# EAGLE design Nucleo_MMI (EAGLE 7.4.0)
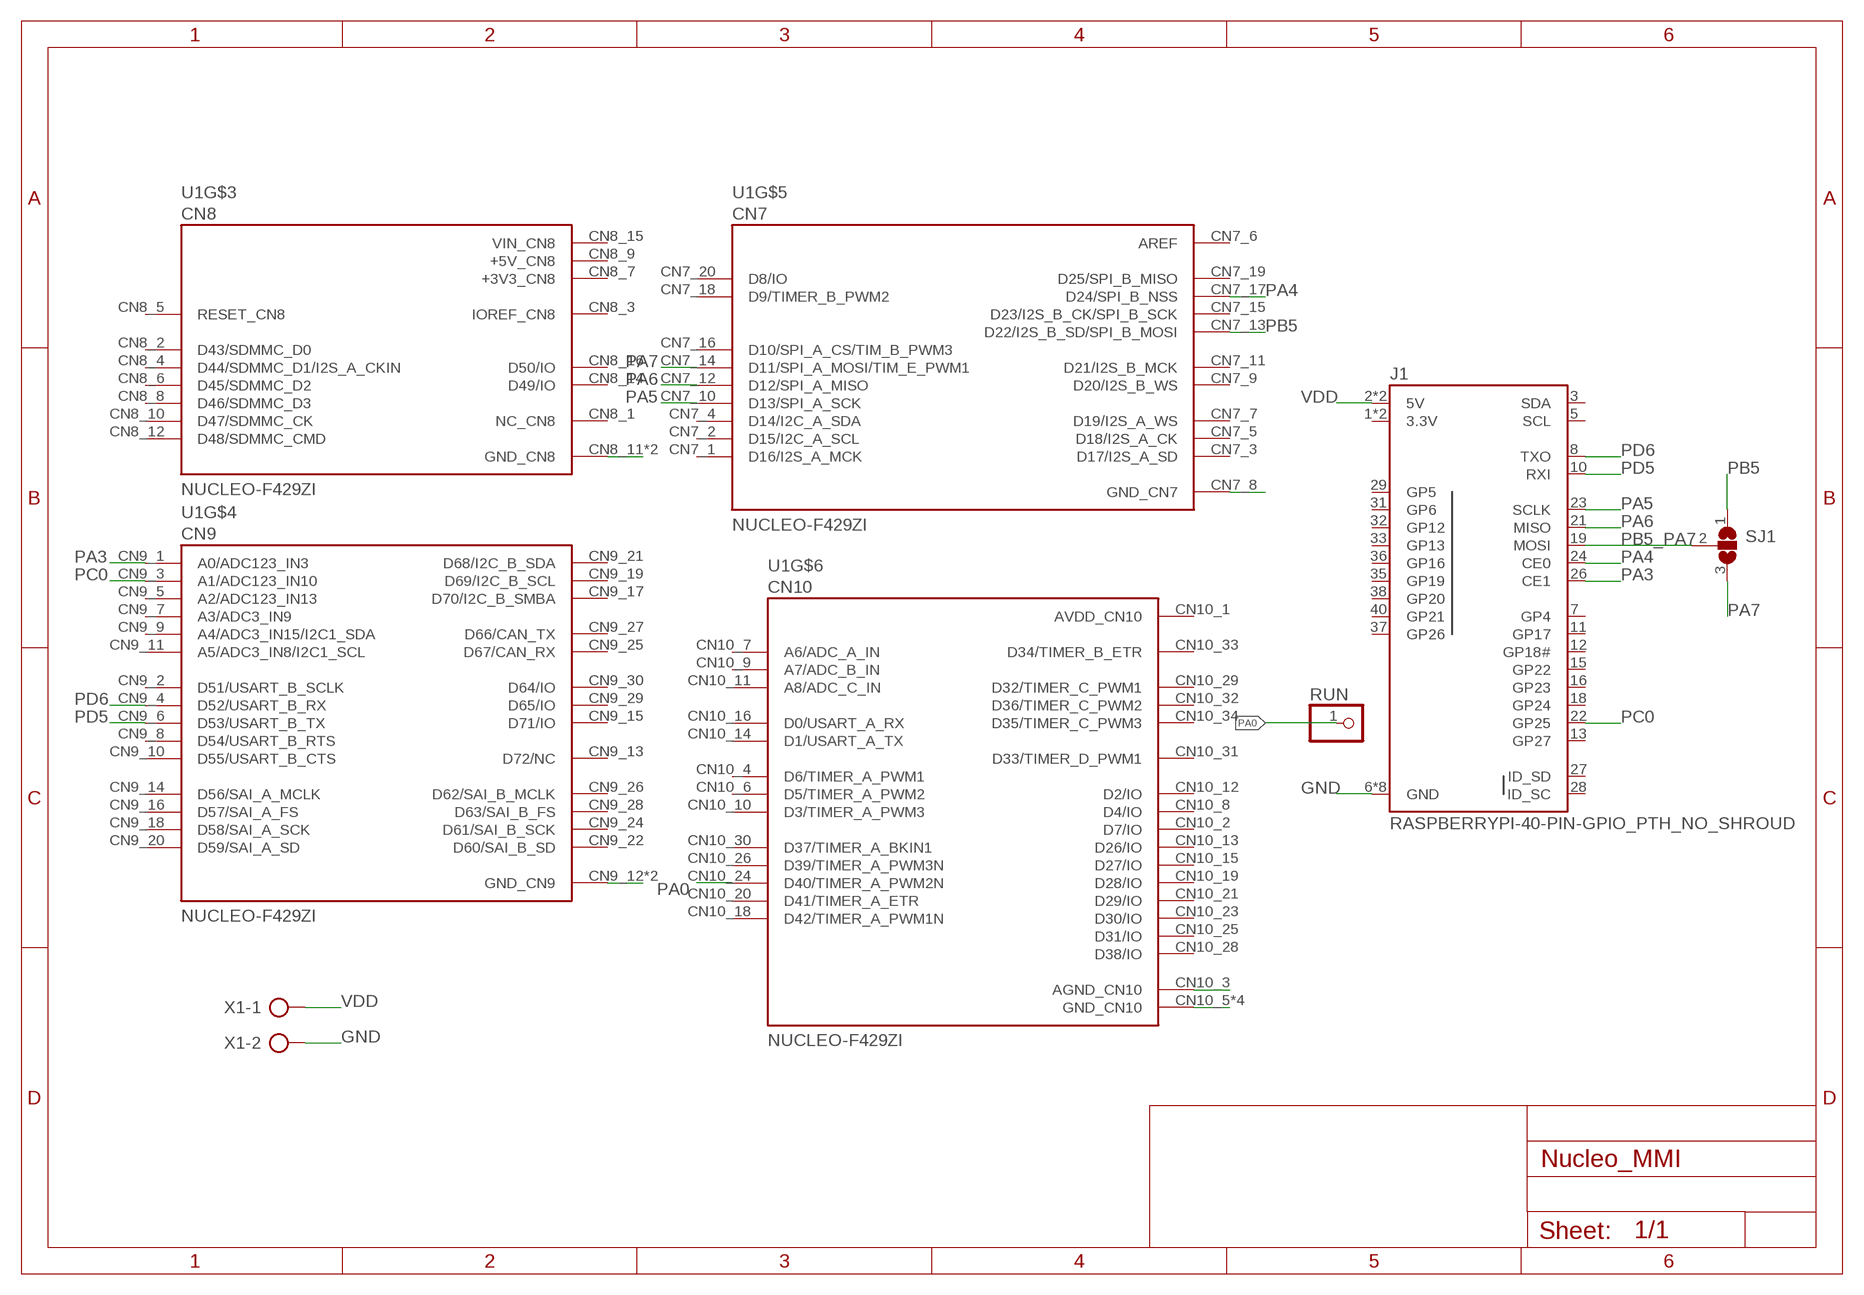
[diagram p0: schematic, sheet 1]

## Parts
J1  RASPBERRYPI-40-PIN-GPIO_PTH_NO_SHROUD  [2X20]
RUN  PINHD-1X1  [1X01]
SJ1  SJ2W  [SJ_2]
U1  NUCLEO-F429ZI  [MODULE_NUCLEO-F429ZI]
X1  AK500/2-H  [AK500/2-H]

## Nets
GND: J1.6(GND) J1.9(GND) J1.14(GND) J1.20(GND) J1.25(GND) J1.30(GND) J1.34(GND) J1.39(GND) U1.CN7_8(GND_CN7) U1.CN8_11(GND_CN8) U1.CN8_13(GND_CN8) U1.CN9_12(GND_CN9) U1.CN9_23(GND_CN9) U1.CN10_3(AGND_CN10) U1.CN10_5(GND_CN10) U1.CN10_17(GND_CN10) U1.CN10_22(GND_CN10) U1.CN10_27(GND_CN10) X1.2
PA0: RUN.1 U1.CN10_24(D40/TIMER_A_PWM2N)
PA3: J1.26(CE1) U1.CN9_1(A0/ADC123_IN3)
PA4: J1.24(CE0) U1.CN7_17(D24/SPI_B_NSS)
PA5: J1.23(SCLK) U1.CN7_10(D13/SPI_A_SCK)
PA6: J1.21(MISO) U1.CN7_12(D12/SPI_A_MISO)
PA7: SJ1.3 U1.CN7_14(D11/SPI_A_MOSI/TIM_E_PWM1)
PB5: SJ1.1 U1.CN7_13(D22/I2S_B_SD/SPI_B_MOSI)
PB5_PA7: J1.19(MOSI) SJ1.2
PC0: J1.22(GP25) U1.CN9_3(A1/ADC123_IN10)
PD5: J1.10(RXI) U1.CN9_6(D53/USART_B_TX)
PD6: J1.8(TXO) U1.CN9_4(D52/USART_B_RX)
VDD: J1.2(5V) J1.4(5V) X1.1
Unconnected: J1.3(SDA) J1.5(SCL) J1.7(GP4) J1.11(GP17) J1.12(GP18#) J1.13(GP27) J1.15(GP22) J1.16(GP23) J1.18(GP24) J1.27(ID_SD) J1.28(ID_SC) J1.29(GP5) J1.31(GP6) J1.32(GP12) J1.33(GP13) J1.35(GP19) J1.36(GP16) J1.37(GP26) J1.38(GP20) J1.40(GP21) U1.CN7_1(D16/I2S_A_MCK) U1.CN7_2(D15/I2C_A_SCL) U1.CN7_3(D17/I2S_A_SD) U1.CN7_4(D14/I2C_A_SDA) U1.CN7_5(D18/I2S_A_CK) U1.CN7_7(D19/I2S_A_WS) U1.CN7_9(D20/I2S_B_WS) U1.CN7_11(D21/I2S_B_MCK) U1.CN7_15(D23/I2S_B_CK/SPI_B_SCK) U1.CN7_16(D10/SPI_A_CS/TIM_B_PWM3) U1.CN7_18(D9/TIMER_B_PWM2) U1.CN7_19(D25/SPI_B_MISO) U1.CN7_20(D8/IO) U1.CN8_1(NC_CN8) U1.CN8_2(D43/SDMMC_D0) U1.CN8_3(IOREF_CN8) U1.CN8_4(D44/SDMMC_D1/I2S_A_CKIN) U1.CN8_5(RESET_CN8) U1.CN8_6(D45/SDMMC_D2) U1.CN8_8(D46/SDMMC_D3) U1.CN8_10(D47/SDMMC_CK) U1.CN8_12(D48/SDMMC_CMD) U1.CN8_14(D49/IO) U1.CN8_16(D50/IO) U1.CN9_2(D51/USART_B_SCLK) U1.CN9_5(A2/ADC123_IN13) U1.CN9_7(A3/ADC3_IN9) U1.CN9_8(D54/USART_B_RTS) U1.CN9_9(A4/ADC3_IN15/I2C1_SDA) U1.CN9_10(D55/USART_B_CTS) U1.CN9_11(A5/ADC3_IN8/I2C1_SCL) U1.CN9_13(D72/NC) U1.CN9_14(D56/SAI_A_MCLK) U1.CN9_15(D71/IO) U1.CN9_16(D57/SAI_A_FS) U1.CN9_17(D70/I2C_B_SMBA) U1.CN9_18(D58/SAI_A_SCK) U1.CN9_19(D69/I2C_B_SCL) U1.CN9_20(D59/SAI_A_SD) U1.CN9_21(D68/I2C_B_SDA) U1.CN9_22(D60/SAI_B_SD) U1.CN9_24(D61/SAI_B_SCK) U1.CN9_25(D67/CAN_RX) U1.CN9_26(D62/SAI_B_MCLK) U1.CN9_27(D66/CAN_TX) U1.CN9_28(D63/SAI_B_FS) U1.CN9_29(D65/IO) U1.CN9_30(D64/IO) U1.CN10_2(D7/IO) U1.CN10_4(D6/TIMER_A_PWM1) U1.CN10_6(D5/TIMER_A_PWM2) U1.CN10_7(A6/ADC_A_IN) U1.CN10_8(D4/IO) U1.CN10_9(A7/ADC_B_IN) U1.CN10_10(D3/TIMER_A_PWM3) U1.CN10_11(A8/ADC_C_IN) U1.CN10_12(D2/IO) U1.CN10_13(D26/IO) U1.CN10_14(D1/USART_A_TX) U1.CN10_15(D27/IO) U1.CN10_16(D0/USART_A_RX) U1.CN10_18(D42/TIMER_A_PWM1N) U1.CN10_19(D28/IO) U1.CN10_20(D41/TIMER_A_ETR) U1.CN10_21(D29/IO) U1.CN10_23(D30/IO) U1.CN10_25(D31/IO) U1.CN10_26(D39/TIMER_A_PWM3N) U1.CN10_28(D38/IO) U1.CN10_29(D32/TIMER_C_PWM1) U1.CN10_30(D37/TIMER_A_BKIN1) U1.CN10_31(D33/TIMER_D_PWM1) U1.CN10_32(D36/TIMER_C_PWM2) U1.CN10_33(D34/TIMER_B_ETR) U1.CN10_34(D35/TIMER_C_PWM3)

## Power pins joined to a net without a drawn wire
3.3V: J1.1(3.3V) J1.17(3.3V)
+3V3_CN8: U1.CN8_7(+3V3_CN8)
+5V_CN8: U1.CN8_9(+5V_CN8)
AREF: U1.CN7_6(AREF)
AVDD_CN10: U1.CN10_1(AVDD_CN10)
VIN_CN8: U1.CN8_15(VIN_CN8)

## Library data of the parts
J1 = SparkFun-Connectors:RASPBERRYPI-40-PIN-GPIO: Raspberry Pi GPIO Header 2x20 pin connector, as found on B, B+, A+ models. Both shrouded PTH and SMT versions available. SparkFun Products: GPIO Shrouded Header <https://www.sparkfun.com/products/13054>- PTH SparkFun Pi Wedge (Preassembled) <https://www.sparkfun.com/products/13717>
RUN = pinhead:PINHD-1X1: PIN HEADER
SJ1 = jumper:SJ2W: SMD solder JUMPER
U1 = NUCLEO-F429ZI:NUCLEO-F429ZI: Check availability <https://pricing.snapeda.com/parts/NUCLEO-F429ZI/STMicroelectronics/view-part?ref=eda>; AVAILABILITY: In Stock; CHECK_PRICES: https://www.snapeda.com/parts/NUCLEO-F429ZI/STMicroelectronics/view-part/?ref=eda; DESCRIPTION: STM32F429ZI, mbed-Enabled Development Nucleo-144 STM32F4 ARM® Cortex®-M4 MCU 32-Bit Embedded Evaluation Board; MF: STMicroelectronics; MP: NUCLEO-F429ZI; PACKAGE: None; PRICE: None; SNAPEDA_LINK: https://www.snapeda.com/parts/NUCLEO-F429ZI/STMicroelectronics/view-part/?ref=snap
X1 = con-ptr500:AK500/2-H: CONNECTOR Aug. 2004 / PTR Meßtechnik: Die Bezeichnung der Serie AK505 wurde geändert. Es handelt sich hierbei um AK500 in horizontaler Ausführung.; OC_FARNELL: unknown; OC_NEWARK: unknown

## Board
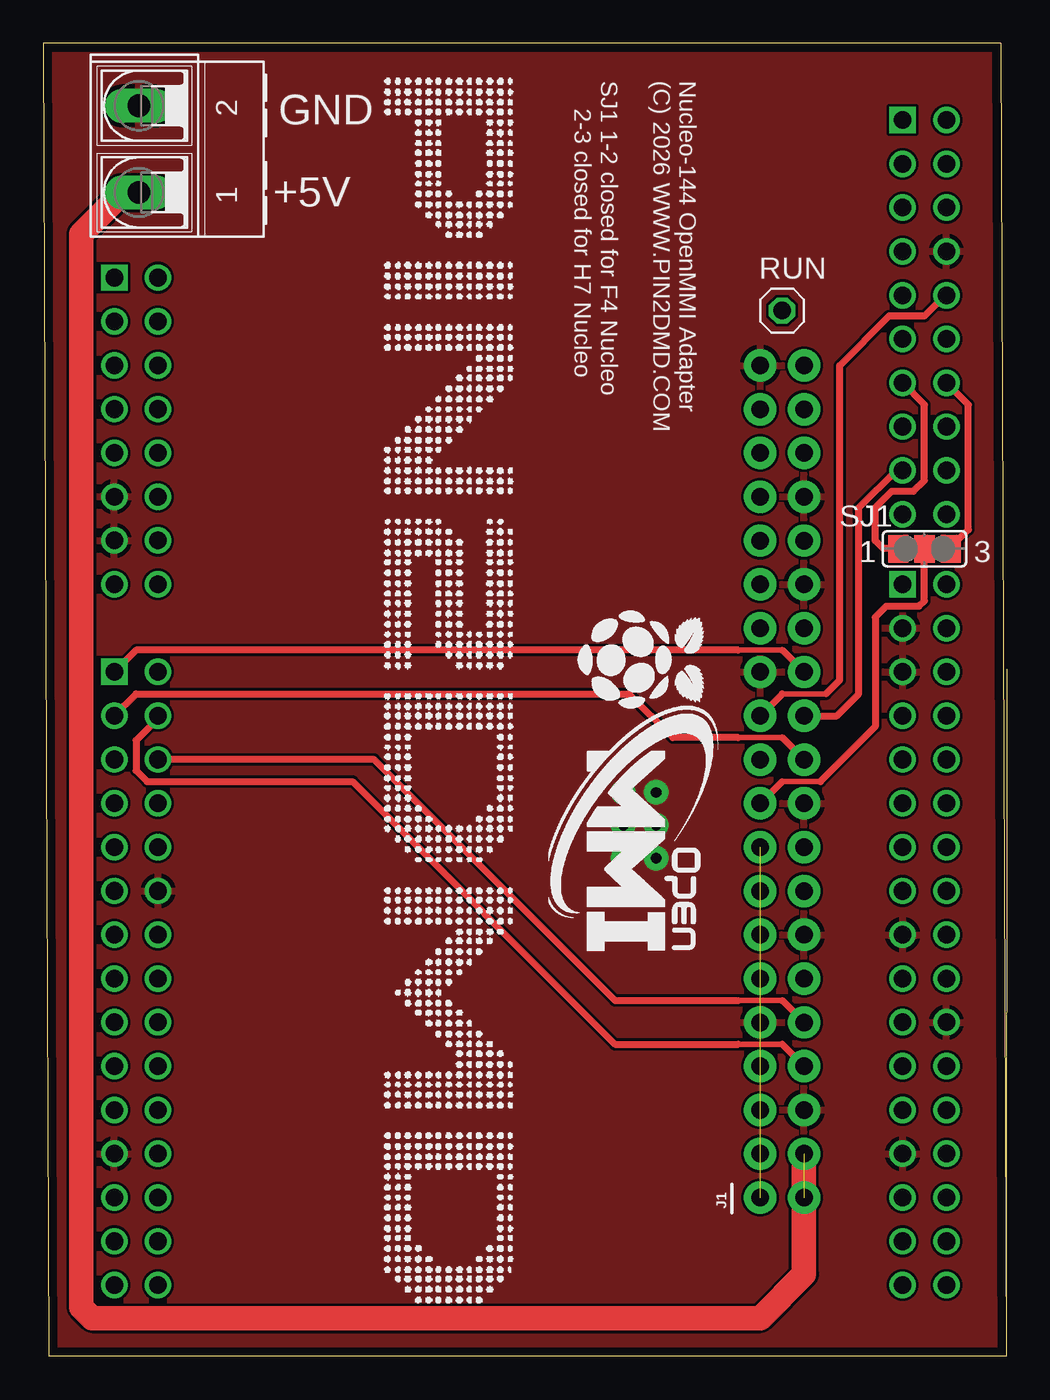
[diagram p1: board, top side]
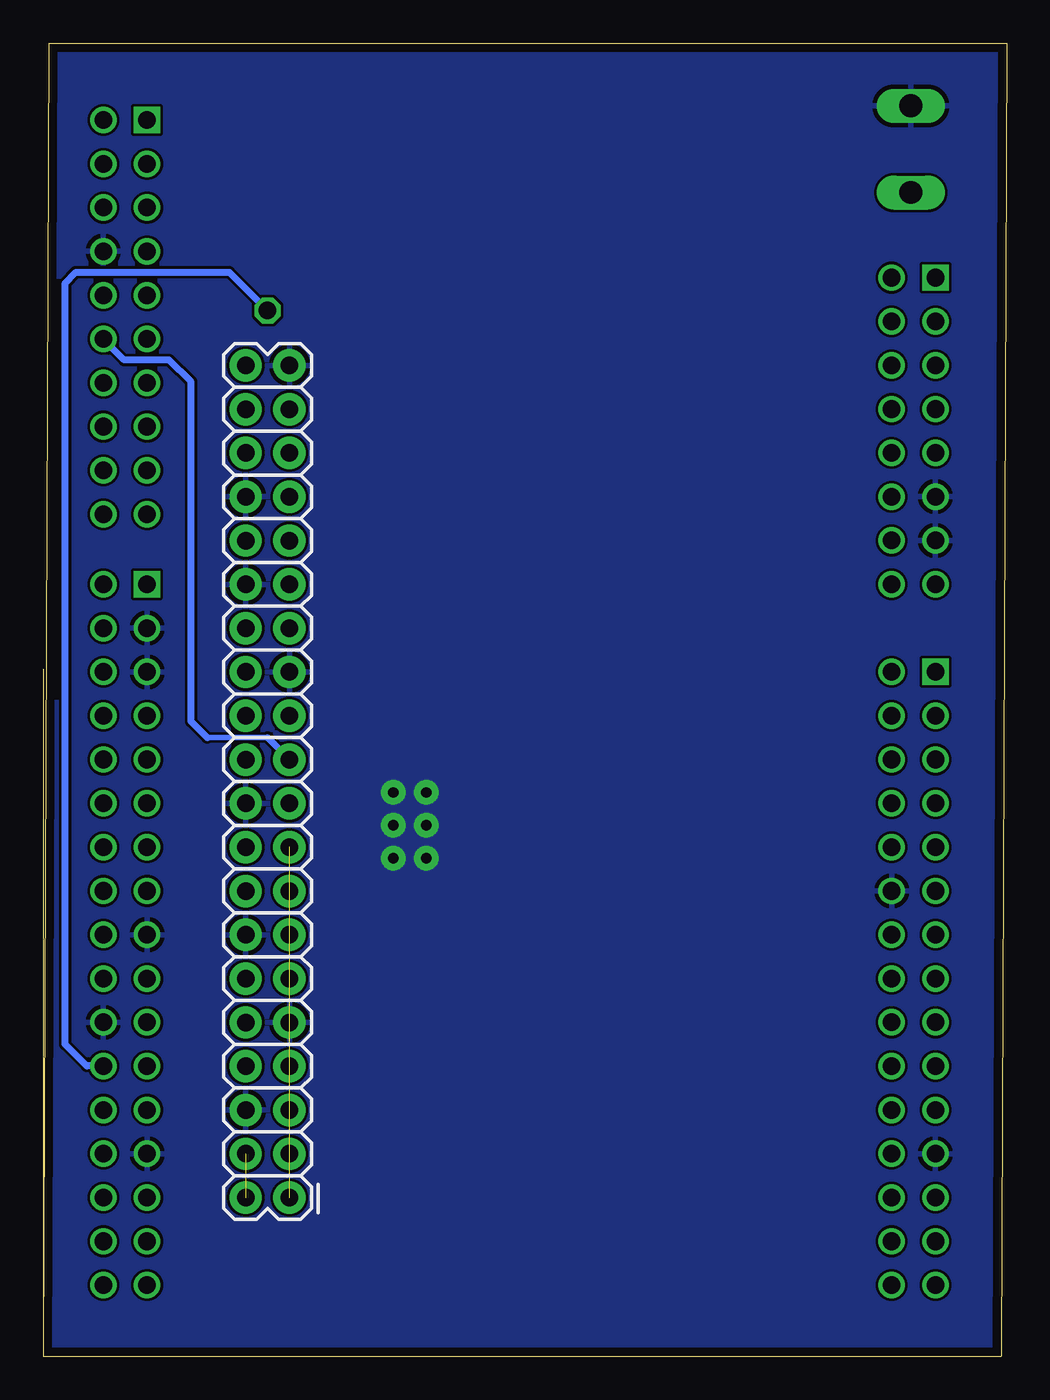
[diagram p2: board, bottom side, seen from below]

Size 55.88 x 76.16 mm. Coordinates in mm from the lower left corner, seen from the top.
Outline: 55.87,0 55.55,76.16 0,76.16 0.32,0 55.87,0
Outline: 55.88,39.85 55.87,0
Copper layers (1*16): Top 0.035mm / dielectric 1.6mm / Bottom 0.035mm
Design rules "Elecrow_2-layer_PCB_eagle_rule": minimum track width 6mil, minimum drill 12mil, track to track 6mil, track to pad 6mil, pad to pad 6mil, via to via 8mil, smd to smd 0mil, copper to edge 20mil, drill to drill 10mil, minimum pad ring 6mil, minimum via ring 6mil, stop-mask expansion 0mil, vias tented up to drill 100mil, thermal gap 10mil

### Footprints (pad centres in the part's own frame; a part is rotated, then mirrored left to right if it is on the bottom)
2X20 = drill 1.016 pad 1.88: 1 0,0; 2 0,2.54; 3 2.54,0; 4 2.54,2.54; 5 5.08,0; 6 5.08,2.54; 7 7.62,0; 8 7.62,2.54; 9 10.16,0; 10 10.16,2.54; 11 12.7,0; 12 12.7,2.54; 13 15.24,0; 14 15.24,2.54; 15 17.78,0; 16 17.78,2.54; 17 20.32,0; 18 20.32,2.54; 19 22.86,0; 20 22.86,2.54; 21 25.4,0; 22 25.4,2.54; 23 27.94,0; 24 27.94,2.54; 25 30.48,0; 26 30.48,2.54; 27 33.02,0; 28 33.02,2.54; 29 35.56,0; 30 35.56,2.54; 31 38.1,0; 32 38.1,2.54; 33 40.64,0; 34 40.64,2.54; 35 43.18,0; 36 43.18,2.54; 37 45.72,0; 38 45.72,2.54; 39 48.26,0; 40 48.26,2.54
1X01 = drill 1.016 octagon: 1 0,0
SJ_2 = smd 1.168 x 1.6: 1 -1.524,0; 2 0,0; 3 1.524,0
MODULE_NUCLEO-F429ZI = drill 1.02 square: CN7_1 20.32,36.454; CN8_1 -25.4,27.31; CN9_1 -25.4,4.45; CN10_1 20.32,9.53 | drill 1.02: CN7_2 22.86,36.454; CN7_3 20.32,33.914; CN7_4 22.86,33.914; CN7_5 20.32,31.374; CN7_6 22.86,31.374; CN7_7 20.32,28.834; CN7_8 22.86,28.834; CN7_9 20.32,26.294; CN7_10 22.86,26.294; CN7_11 20.32,23.754; CN7_12 22.86,23.754; CN7_13 20.32,21.214; CN7_14 22.86,21.214; CN7_15 20.32,18.674; CN7_16 22.86,18.674; CN7_17 20.32,16.134; CN7_18 22.86,16.134; CN7_19 20.32,13.594; CN7_20 22.86,13.594; CN8_2 -22.86,27.31; CN8_3 -25.4,24.77; CN8_4 -22.86,24.77; CN8_5 -25.4,22.23; CN8_6 -22.86,22.23; CN8_7 -25.4,19.69; CN8_8 -22.86,19.69; CN8_9 -25.4,17.15; CN8_10 -22.86,17.15; CN8_11 -25.4,14.61; CN8_12 -22.86,14.61; CN8_13 -25.4,12.07; CN8_14 -22.86,12.07; CN8_15 -25.4,9.53; CN8_16 -22.86,9.53; CN9_2 -22.86,4.45; CN9_3 -25.4,1.91; CN9_4 -22.86,1.91; CN9_5 -25.4,-0.63; CN9_6 -22.86,-0.63; CN9_7 -25.4,-3.17; CN9_8 -22.86,-3.17; CN9_9 -25.4,-5.71; CN9_10 -22.86,-5.71; CN9_11 -25.4,-8.25; CN9_12 -22.86,-8.25; CN9_13 -25.4,-10.79; CN9_14 -22.86,-10.79; CN9_15 -25.4,-13.33; CN9_16 -22.86,-13.33; CN9_17 -25.4,-15.87; CN9_18 -22.86,-15.87; CN9_19 -25.4,-18.41; CN9_20 -22.86,-18.41; CN9_21 -25.4,-20.95; CN9_22 -22.86,-20.95; CN9_23 -25.4,-23.49; CN9_24 -22.86,-23.49; CN9_25 -25.4,-26.03; CN9_26 -22.86,-26.03; CN9_27 -25.4,-28.57; CN9_28 -22.86,-28.57; CN9_29 -25.4,-31.11; CN9_30 -22.86,-31.11; CN10_2 22.86,9.53; CN10_3 20.32,6.99; CN10_4 22.86,6.99; CN10_5 20.32,4.45; CN10_6 22.86,4.45; CN10_7 20.32,1.91; CN10_8 22.86,1.91; CN10_9 20.32,-0.63; CN10_10 22.86,-0.63; CN10_11 20.32,-3.17; CN10_12 22.86,-3.17; CN10_13 20.32,-5.71; CN10_14 22.86,-5.71; CN10_15 20.32,-8.25; CN10_16 22.86,-8.25; CN10_17 20.32,-10.79; CN10_18 22.86,-10.79; CN10_19 20.32,-13.33; CN10_20 22.86,-13.33; CN10_21 20.32,-15.87; CN10_22 22.86,-15.87; CN10_23 20.32,-18.41; CN10_24 22.86,-18.41; CN10_25 20.32,-20.95; CN10_26 22.86,-20.95; CN10_27 20.32,-23.49; CN10_28 22.86,-23.49; CN10_29 20.32,-26.03; CN10_30 22.86,-26.03; CN10_31 20.32,-28.57; CN10_32 22.86,-28.57; CN10_33 20.32,-31.11; CN10_34 22.86,-31.11
AK500/2-H = drill 1.321 long: 1 -2.515,0; 2 2.515,0

### Placement (x,y rotation side)
J1  41.59,9.21 90 bottom
RUN  42.86,60.64 0 top
SJ1  51.12,46.83 0 top
U1  29.53,35.24 0 top
X1  5.56,70.01 90 top

### Tracks (layer width: path | path; a pad name or v marks a point on that pad's centre or on a via)
3.3V  (1 unrouted)
GND  (via drill 0.6 pad 1.42)
  other vias: 33.66,28.89 33.66,30.8 33.66,32.7 35.56,32.7 35.56,30.8 35.56,28.89
  pour Bottom: 0,76.16 55.55,76.16 55.87,0 0.32,0
  pour Top: 0.32,0 55.87,0 55.55,76.16 0,76.16
PA0
  Bottom 0.406: U1.CN10_24 53.35,16.83 54.61,18.1 54.61,62.23 53.97,62.87 45.08,62.87 RUN.1
PA3
  Top 0.305: 42.86,40.96 40.32,40.96
  Top 0.406: U1.CN9_1 5.39,40.96 40.32,40.96 | J1.26 42.86,40.96
PA4
  Top 0.406: J1.24 46.04,37.15 47.31,38.42 47.31,49.21 49.47,51.38 U1.CN7_17
PA5
  Top 0.305: 42.86,38.42 45.4,38.42
  Top 0.406: U1.CN7_10 52.33,61.54 51.12,60.33 49.05,60.33 46.2,57.47 46.2,39.21 45.4,38.42 | 42.86,38.42 J1.23
PA6
  Bottom 0.305: 42.86,35.88 46.36,35.88
  Bottom 0.406: J1.21 42.86,35.88 | 46.36,35.88 47.31,36.83 47.31,56.52 48.58,57.78 51.18,57.78 U1.CN7_12
PA7
  Top 0.406: 52.33,56.46 U1.CN7_14 53.66,55.19 53.66,47.94 52.64,46.93 SJ1.3
PB5
  Top 0.406: SJ1.1 48.74,46.83 48.26,47.31 48.26,49.21 49.21,50.16 50.48,50.16 51.12,50.8 51.12,55.19 U1.CN7_13
PB5_PA7
  Top 0.305: 42.86,33.34 45.08,33.34
  Top 0.406: J1.19 42.86,33.34 | 45.08,33.34 48.26,36.51 48.26,42.86 48.9,43.5 50.8,43.5 51.12,43.81 SJ1.2
PC0
  Top 0.305: 40.32,35.88 42.86,35.88
  Top 0.406: U1.CN9_3 5.4,38.42 33.97,38.42 36.51,35.88 40.32,35.88 | J1.22 42.86,35.88
PD5
  Top 0.305: 40.32,20.64 42.86,20.64
  Top 0.406: J1.10 42.86,20.64 | U1.CN9_6 19.21,34.61 33.18,20.64 40.32,20.64
PD6
  Top 0.305: 40.32,18.1 42.86,18.1
  Top 0.406: J1.8 42.86,18.1 | U1.CN9_4 6.67,36.99 5.4,35.72 5.4,33.97 6.03,33.34 17.94,33.34 33.18,18.1 40.32,18.1
VDD  (1 unrouted)
  Top 1.422: X1.1 4.63,67.49 2.22,65.09 2.22,2.86 2.86,2.22 41.59,2.22 44.13,4.76 J1.4

### Text on the board
tNames: Nucleo-144 OpenMMI Adapter / (C) 2026 WWW.PIN2DMD.COM / / SJ1 1-2 closed for F4 Nucleo / 2-3 closed for H7 Nucleo | GND | +5V | 1 | 3